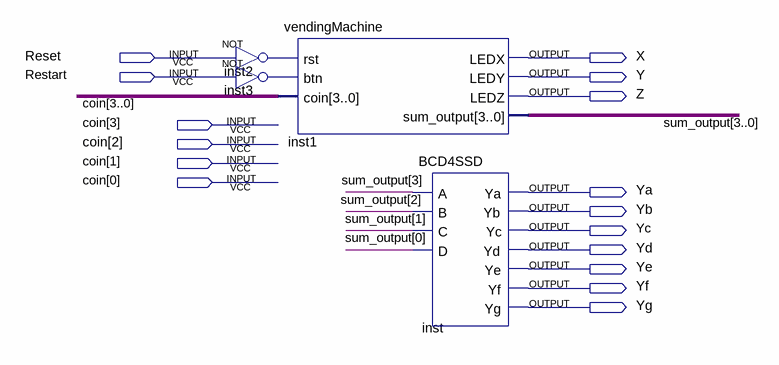
[diagram p0: schematic sheet]
// Quartus schematic task2B.bdf as structural Verilog: 4 symbols, 16 pins
module task2B (
  input  Reset,
  input  Restart,
  input  [3:0] coin,
  output X,
  output Y,
  output Z,
  output Ya,
  output Yb,
  output Yc,
  output Yd,
  output Ye,
  output Yf,
  output Yg
);

  wire inst2_out, inst3_out;
  wire [3:0] sum_output;

  not inst2 (inst2_out, Reset);
  not inst3 (inst3_out, Restart);
  vendingMachine inst1 (
    .rst(inst2_out), .btn(inst3_out), .coin(coin), .LEDX(X), .LEDY(Y), .LEDZ(Z), .sum_output(sum_output));
  BCD4SSD inst (
    .A(sum_output[3]), .B(sum_output[2]), .C(sum_output[1]), .D(sum_output[0]), .Ya(Ya), .Yb(Yb), .Yc(Yc),
    .Yd(Yd), .Ye(Ye), .Yf(Yf), .Yg(Yg));
endmodule
